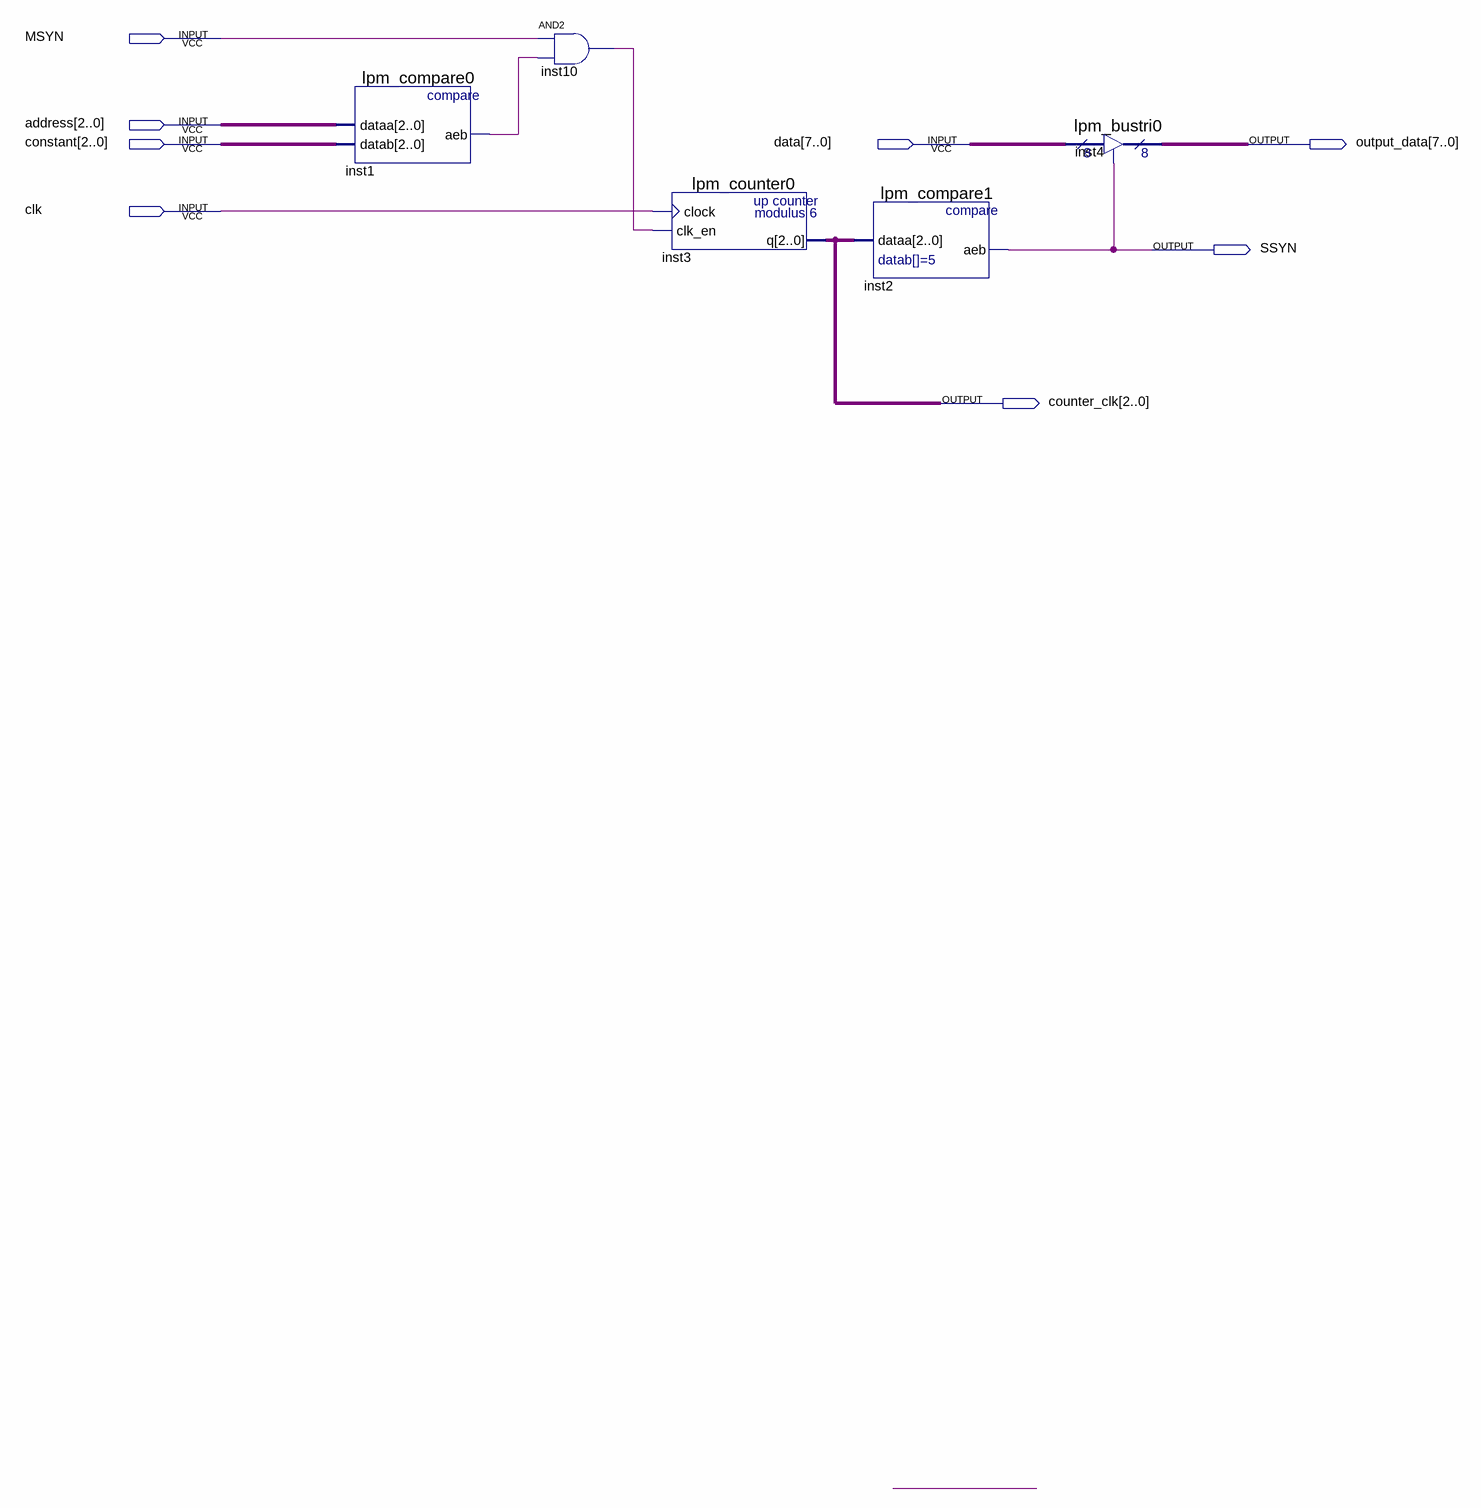
[diagram p0: schematic sheet]
// Quartus schematic slave.bdf as structural Verilog: 5 symbols, 8 pins
module slave (
  input  MSYN,
  input  [2:0] address,
  input  [2:0] constant,
  input  [7:0] data,
  input  clk,
  output [7:0] output_data,
  output SSYN,
  output [2:0] counter_clk
);

  wire inst1_aeb, inst10_out;

  lpm_compare0 inst1 (.dataa(address), .datab(constant), .aeb(inst1_aeb));
  and inst10 (inst10_out, MSYN, inst1_aeb);
  lpm_counter0 inst3 (.clock(clk), .clk_en(inst10_out), .q(counter_clk));
  lpm_compare1 inst2 (.dataa(counter_clk), .aeb(SSYN));
  lpm_bustri0 inst4 (.enabledt(SSYN), .data(data), .tridata(output_data));
endmodule
